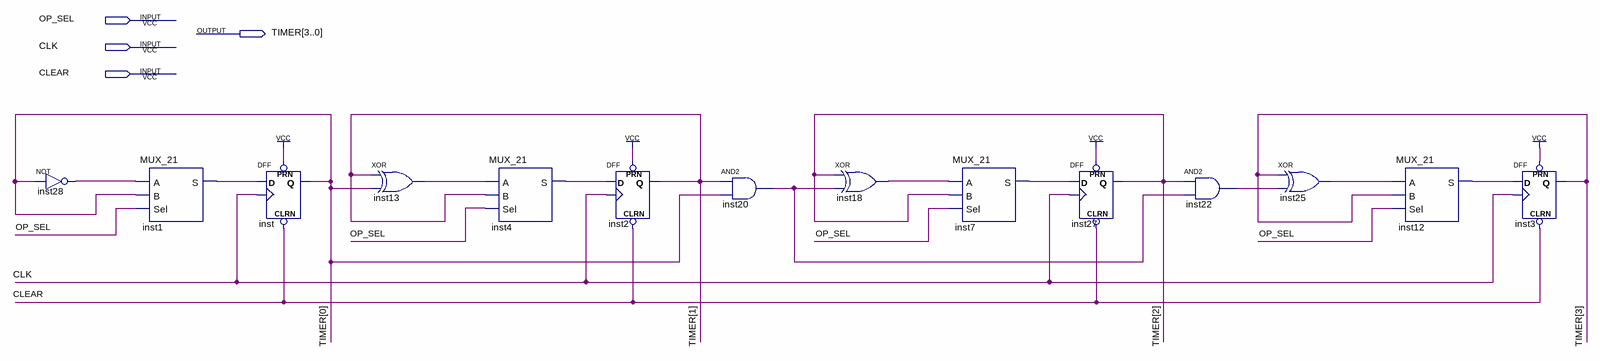
[diagram p0: schematic sheet]
// Quartus schematic TIMER_COUNTER.bdf as structural Verilog: 14 symbols, 4 pins
module TIMER_COUNTER (
  input  OP_SEL,
  input  CLK,
  input  CLEAR,
  output [3:0] TIMER
);

  wire inst1_s, inst4_s, inst7_s, inst12_s, inst13_out, inst18_out, inst20_out, inst22_out, inst25_out,
       inst28_out;

  not inst28 (inst28_out, TIMER[0]);
  MUX_21 inst1 (.A(inst28_out), .B(TIMER[0]), .Sel(OP_SEL), .S(inst1_s));
  DFF inst (.CLRN(CLEAR), .CLK(CLK), .D(inst1_s), .PRN(1'b1), .Q(TIMER[0]));
  xor inst13 (inst13_out, TIMER[1], TIMER[0]);
  MUX_21 inst4 (.A(inst13_out), .B(TIMER[1]), .Sel(OP_SEL), .S(inst4_s));
  DFF inst2 (.CLRN(CLEAR), .CLK(CLK), .D(inst4_s), .PRN(1'b1), .Q(TIMER[1]));
  and inst20 (inst20_out, TIMER[1], TIMER[0]);
  xor inst18 (inst18_out, TIMER[2], inst20_out);
  MUX_21 inst7 (.A(inst18_out), .B(TIMER[2]), .Sel(OP_SEL), .S(inst7_s));
  DFF inst27 (.CLRN(CLEAR), .CLK(CLK), .D(inst7_s), .PRN(1'b1), .Q(TIMER[2]));
  and inst22 (inst22_out, TIMER[2], inst20_out);
  xor inst25 (inst25_out, TIMER[3], inst22_out);
  MUX_21 inst12 (.A(inst25_out), .B(TIMER[3]), .Sel(OP_SEL), .S(inst12_s));
  DFF inst3 (.CLRN(CLEAR), .CLK(CLK), .D(inst12_s), .PRN(1'b1), .Q(TIMER[3]));
endmodule
